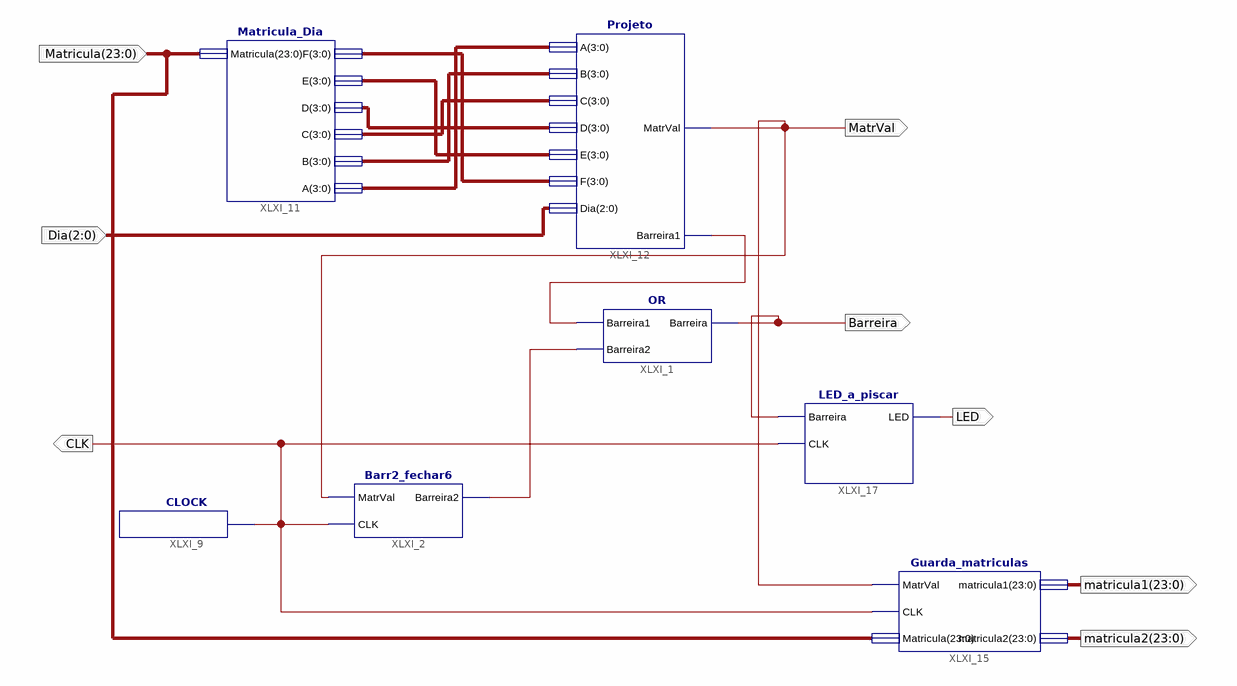
[diagram p0: schematic sheet 1]
// Xilinx ISE schematic ProjetoFase2.sch (spartan6) as structural Verilog: 7 symbols, 8 ports
module ProjetoFase2 (
  input  [2:0] Dia,
  input  [23:0] Matricula,
  output Barreira,
  output MatrVal,
  output CLK,
  output LED,
  output [23:0] matricula1,
  output [23:0] matricula2
);

  wire XLXN_28, XLXN_29;
  wire [3:0] XLXN_11, XLXN_12, XLXN_13, XLXN_14, XLXN_15, XLXN_16;

  OR XLXI_1 (.Barreira1(XLXN_28), .Barreira2(XLXN_29), .Barreira(Barreira));
  Barr2_fechar6 XLXI_2 (.MatrVal(MatrVal), .CLK(CLK), .Barreira2(XLXN_29));
  CLOCK XLXI_9 (.CLK(CLK));
  Matricula_Dia XLXI_11 (
    .Matricula(Matricula), .F(XLXN_16), .E(XLXN_15), .D(XLXN_14), .C(XLXN_13), .B(XLXN_12), .A(XLXN_11));
  Projeto XLXI_12 (
    .A(XLXN_11), .B(XLXN_12), .C(XLXN_13), .D(XLXN_14), .E(XLXN_15), .F(XLXN_16), .Dia(Dia),
    .MatrVal(MatrVal), .Barreira1(XLXN_28));
  Guarda_matriculas XLXI_15 (
    .MatrVal(MatrVal), .CLK(CLK), .Matricula(Matricula), .matricula1(matricula1), .matricula2(matricula2));
  LED_a_piscar XLXI_17 (.Barreira(Barreira), .CLK(CLK), .LED(LED));
endmodule
